# Altium schematic sheet Voltage Translators.SchDoc: 电动汽车电池管理系统
size A4; Address1: 先进成图技术赛道国赛试题; Address2: 陈大勇; Address3: 000000000000000000; Address4: DZ001; SheetNumber: 5; SheetTotal: 5
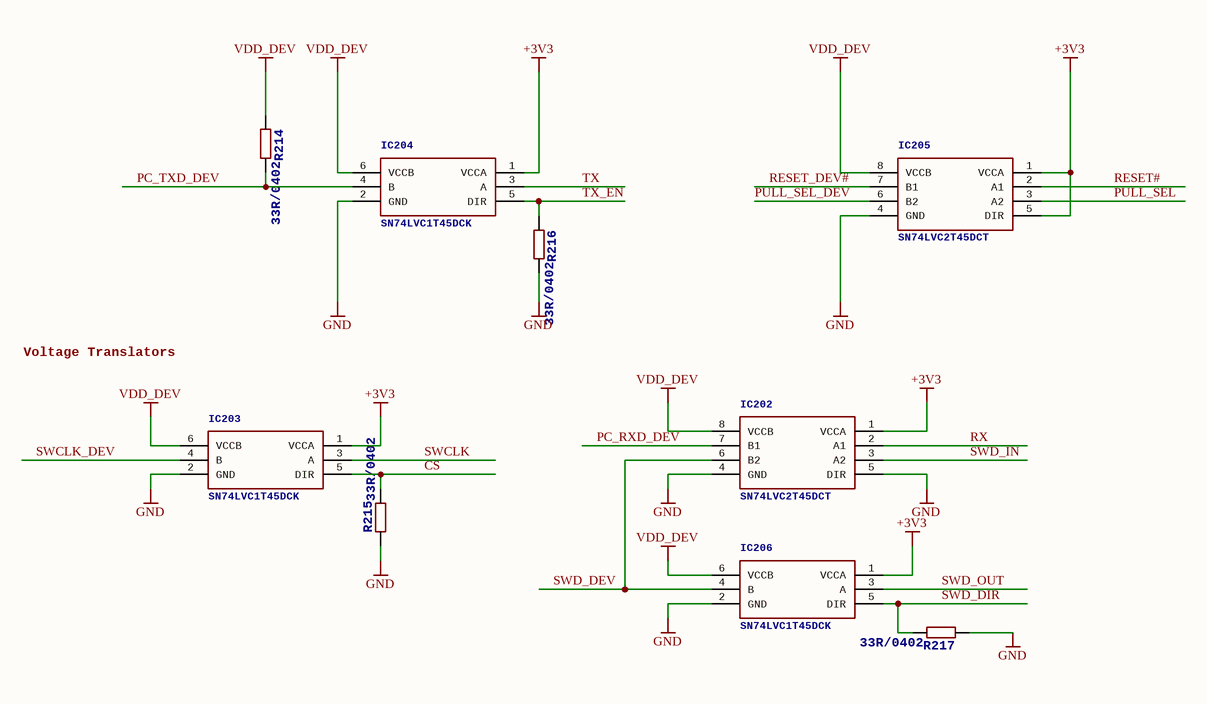
[diagram p0: Voltage Translators.SchDoc]

## Parts
IC202  SN74LVC2T45DCT  [DCT_R-PDSO-G8]
IC203  SN74LVC1T45DCK  [DCK_R-PDSO-G6]
IC204  SN74LVC1T45DCK  [DCK_R-PDSO-G6]
IC205  SN74LVC2T45DCT  [DCT_R-PDSO-G8]
IC206  SN74LVC1T45DCK  [DCK_R-PDSO-G6]
R214  33R/0402  [R0402]
R215  33R/0402  [R0402]
R216  33R/0402  [R0402]
R217  33R/0402  [R0402]

## Nets
+3V3: IC202.1(VCCA) IC203.1(VCCA) IC204.1(VCCA) IC205.1(VCCA) IC205.5(DIR) IC206.1(VCCA)
GND: IC202.4(GND) IC202.5(DIR) IC203.2(GND) IC204.2(GND) IC205.4(GND) IC206.2(GND) R215.1 R216.2 R217.1
VDD_DEV: IC202.8(VCCB) IC203.6(VCCB) IC204.6(VCCB) IC205.8(VCCB) IC206.6(VCCB) R214.1
CS: IC203.5(DIR) R215.2
PC_RXD_DEV: IC202.7(B1)
PC_TXD_DEV: IC204.4(B) R214.2
PULL_SEL: IC205.3(A2)
PULL_SEL_DEV: IC205.6(B2)
RESET#: IC205.2(A1)
RESET_DEV#: IC205.7(B1)
RX: IC202.2(A1)
SWCLK: IC203.3(A)
SWCLK_DEV: IC203.4(B)
SWD_DEV: IC202.6(B2) IC206.4(B)
SWD_DIR: IC206.5(DIR) R217.2
SWD_IN: IC202.3(A2)
SWD_OUT: IC206.3(A)
TX: IC204.3(A)
TX_EN: IC204.5(DIR) R216.1

## Notes on the sheet
- Voltage Translators
- 项目名称
- 选手信息
- 当前日期
- 图页名称
- 当前时间
- 第           幅
- 共           幅

## Library data of the parts
R214-R217 = R-EU_R0402